# Altium schematic sheet MotorDriver.SchDoc
size A4; SheetNumber: 4; SheetTotal: 8
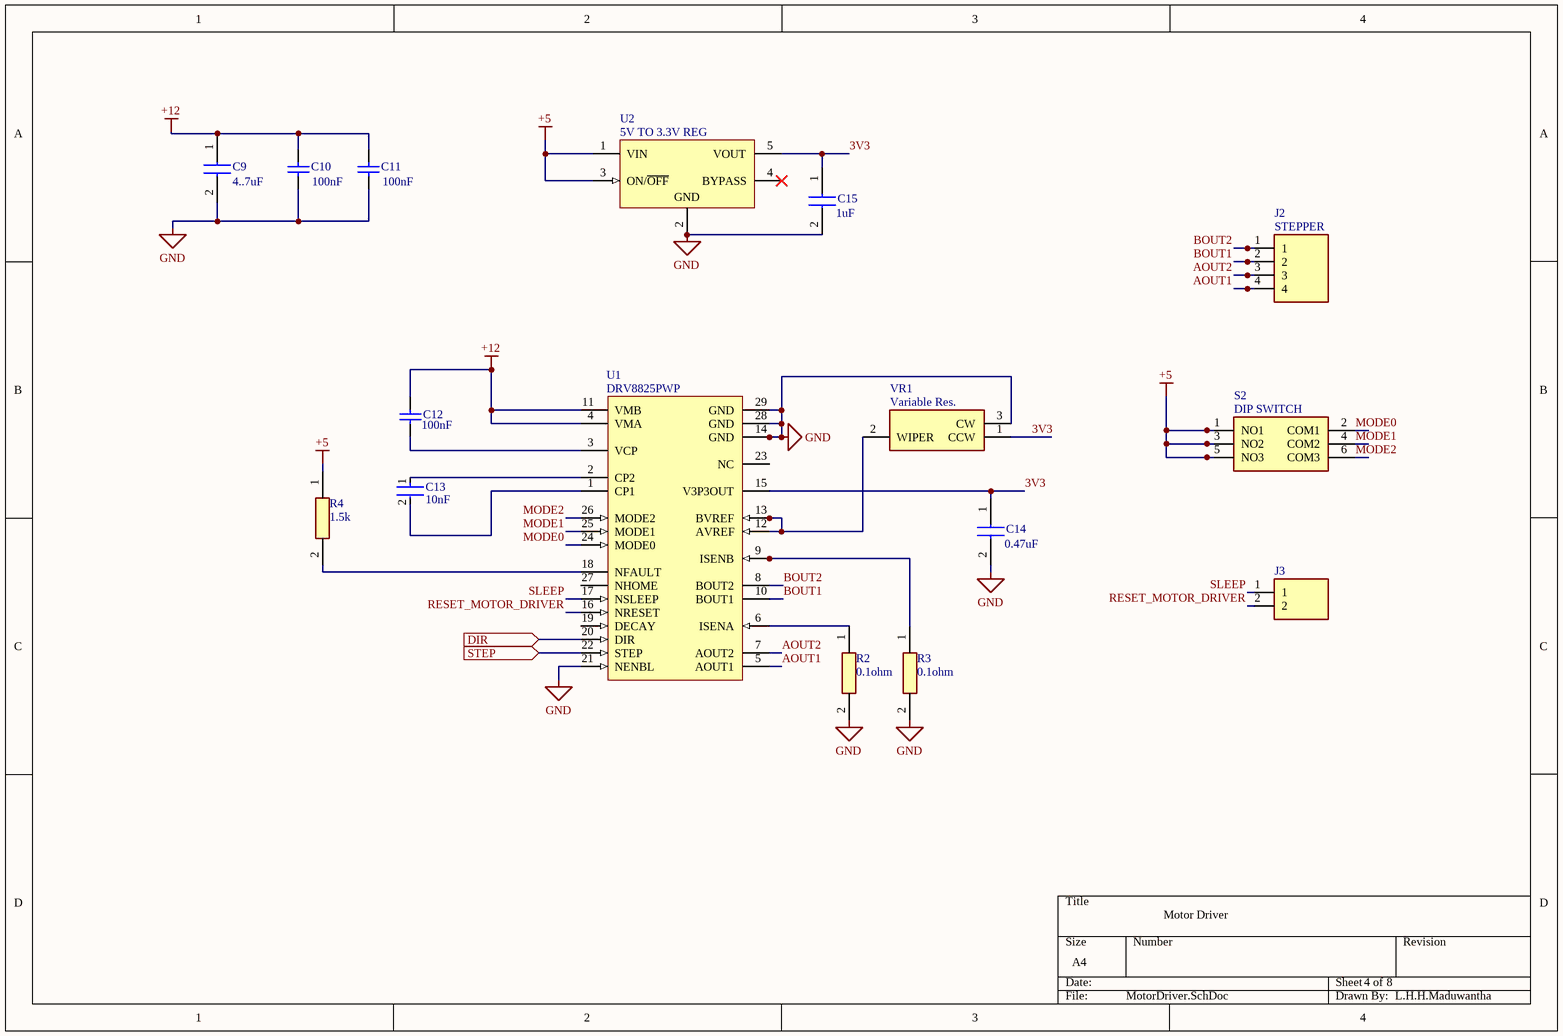
[diagram p0: MotorDriver.SchDoc]

## Parts
C9  Capacitance: 4..7uF  [C1210]  (hidden comment: C1210C475J5RACAUTO)
C10  value 100nF  [CAPC1608X90X35LL15T15]  (hidden comment: 06035C104KAT4A)
C11  value 100nF  [CAPC1608X90X35LL15T15]  (hidden comment: 06035C104KAT4A)
C12  value 100nF  [CAPC1608X90X35LL15T15]  (hidden comment: 06035C104KAT4A)
C13  Capacitance: 10nF  [FP-GRM155-0_05-IPC_A]  (hidden comment: GRM155R71H103JA88D)
C14  Capacitance: 0.47uF  [CAPC2012X110N]  (hidden comment: C0805C474J5REC7800)
C15  CAPACITANCE: 1uF  [CAPC1608X95N]  (hidden comment: C0603C105K3PACTU.)
J2  NAME: STEPPER  [B4BXHALFSN]  (hidden comment: B4B-XH-A_LF__SN_)
J3  61300211121  [HDRV2W110P0X254_1X2_508X254X854P]  (value not drawn)
R2  Resistance: 0.1ohm  [ERJ3_B_BQ_BW_LW_(0603)]  (hidden comment: ERJ-3RSFR10V)
R3  Resistance: 0.1ohm  [ERJ3_B_BQ_BW_LW_(0603)]  (hidden comment: ERJ-3RSFR10V)
R4  RESISTANCE: 1.5k  [ERA2AED122X]  (hidden comment: ERA-2AEB152X)
S2  NAME: DIP SWITCH  [BD03]  (hidden comment: BD03)
U1  DRV8825PWP  [PWP0028C_L]
U2  NAME: 5V TO 3.3V REG  [DBV0005A_M]  (hidden comment: LP2985-33DBVR)
VR1  NAME: Variable Res.  [TC33X2503E]  (hidden comment: TC33X-2-103E)

## Ports
DIR (in, see Main[3A]), STEP (in, see Main[3A])

## Nets
+5: R4.1 S2.1(NO1) S2.3(NO2) S2.5(NO3) U2.1(VIN) U2.3(ON/~{OFF})
+12: C9.1 C10.2 C11.2 C12.2 U1.4(VMA) U1.11(VMB)
GND: C9.2 C10.1 C11.1 C14.2 C15.2 R2.2 R3.2 U1.14(GND) U1.21(NENBL) U1.28(GND) U1.29(GND) U2.2(GND) VR1.3(CW)
3V3: C14.1 C15.1 U1.15(V3P3OUT) U2.5(VOUT) VR1.1(CCW)
AOUT1: J2.4 U1.5(AOUT1)
AOUT2: J2.3 U1.7(AOUT2)
BOUT1: J2.2 U1.10(BOUT1)
BOUT2: J2.1 U1.8(BOUT2)
DIR: U1.20(DIR) ; port DIR
MODE0: S2.2(COM1) U1.24(MODE0)
MODE1: S2.4(COM2) U1.25(MODE1)
MODE2: S2.6(COM3) U1.26(MODE2)
RESET_MOTOR_DRIVER: J3.2 U1.16(NRESET)
SLEEP: J3.1 U1.17(NSLEEP)
STEP: U1.22(STEP) ; port STEP
NetC12_1: C12.1 U1.3(VCP)
NetC13_1: C13.1 U1.2(CP2)
NetC13_2: C13.2 U1.1(CP1)
NetR2_1: R2.1 U1.6(ISENA)
NetR3_1: R3.1 U1.9(ISENB)
NetR4_2: R4.2 U1.18(NFAULT)
NetU1_12: U1.12(AVREF) U1.13(BVREF) VR1.2(WIPER)

Not connected (* = marked no-connect by the designer): U1 19(DECAY) 23(NC) 27(NHOME); U2 4(BYPASS)*

## Notes on the sheet
- Motor Driver
- L.H.H.Maduwantha

## Library data of the parts
C9 = C1210C475J5RACAUTO: Capacitor; Manufacturer_Name: KEMET; Datasheet Link: https://content.kemet.com/datasheets/KEM_C1023_X7R_AUTO_SMD.pdf; Manufacturer_Part_Number: C1210C475J5RACAUTO; Mouser Part Number: 80-C1210C475J5RAUTO; Mouser Price/Stock: https://www.mouser.co.uk/ProductDetail/KEMET/C1210C475J5RACAUTO?qs=sSYV1F9c5cHOvq7Y3pUhfA%3D%3D
C10-C12 = CMP-2006-04390-1: Manufacturer: AVX Interconnect / Elco; Part Number: 06035C104KAT4A
C13 = CMP-2008-04636-2: Chip Multilayer Ceramic Capacitors for General Purpose, 0402, 10000pF, X7R, 15%, 5%, 50V; Depth: 0.5mm; Case Code (Imperial): 0402; Dielectric: X7R; Voltage: 50V; Min Operating Temperature: -55°C; Packaging: Tape and Reel; Tolerance: 5%; Case Code (Metric): 1005; Package Quantity: 10000; Lead Free: Lead Free; Length: 1mm; Voltage Rating (DC): 50V; Termination: SMD/SMT; Width: 0.5mm; Height: 0.5mm; Voltage Rating: 50V; Case/Package: 0402; Max Operating Temperature: 125°C; Thickness: 0.022inch; Mount: Surface Mount; Material: Ceramic
C14 = C0805C474J5REC7800: Capacitor; Manufacturer_Name: KEMET; Datasheet Link: https://api.kemet.com/component-edge/download/datasheet/C0805C474J5REC7800.pdf; Height: 1.1mm; Manufacturer_Part_Number: C0805C474J5REC7800; Mouser Part Number: N/A; Mouser Price/Stock: https://www.mouser.co.uk/ProductDetail/KEMET/C0805C474J5REC7800?qs=xZ%2FP%252Ba9zWqYCFwa%2FovZJlA%3D%3D
C15 = C0603C105K3PACTU.: Capacitor; Manufacturer_Name: KEMET; Datasheet Link: https://www.kemet.com/specsheet/C0603C105K3PACTU; Height: 0.95mm; Manufacturer_Part_Number: C0603C105K3PACTU.; Mouser Part Number: N/A; Mouser Price/Stock: https://www.mouser.com/Search/Refine.aspx?Keyword=N%2FA
J2 = B4B-XH-A_LF__SN_: Connector; Manufacturer_Name: JST (JAPAN SOLDERLESS TERMINALS); Manufacturer_Part_Number: B4B-XH-A(LF)(SN); Datasheet Link: https://datasheet.lcsc.com/szlcsc/JST-Sales-America-B4B-XH-A-LF-SN_C144395.pdf; Height: 7mm; Arrow Part Number: B4B-XH-A(LF)(SN); Arrow Price/Stock: https://www.arrow.com/en/products/b4b-xh-a-lf-sn/jst-manufacturing?region=europe
J3 = 61300211121: Connector; Manufacturer_Name: Wurth Elektronik; Datasheet Link: https://componentsearchengine.com/Datasheets/2/61300211121.pdf; Height: 8.54mm; Manufacturer_Part_Number: 61300211121; Mouser Part Number: 710-61300211121; Mouser Price/Stock: https://www.mouser.co.uk/ProductDetail/Wurth-Elektronik/61300211121?qs=t4813l51qx%252B1A5GYDQxPlw%3D%3D
R2 R3 = ERJ-3RSFR10V: Resistor; Manufacturer_Name: Panasonic; Datasheet Link: http://industrial.panasonic.com/cdbs/www-data/pdf/RDN0000/AOA0000C313.pdf; Manufacturer_Part_Number: ERJ-3RSFR10V; Mouser Part Number: 667-ERJ-3RSFR10V; Mouser Price/Stock: https://www.mouser.co.uk/ProductDetail/Panasonic/ERJ-3RSFR10V?qs=aGgfWYEhH7mX3YEBaR1Eig%3D%3D; Arrow Part Number: ERJ-3RSFR10V; Arrow Price/Stock: https://www.arrow.com/en/products/erj-3rsfr10v/panasonic?region=nac
R4 = ERA-2AEB152X: Resistor; Manufacturer_Name: Panasonic; Datasheet Link: http://industrial.panasonic.com/cdbs/www-data/pdf/RDM0000/AOA0000C307.pdf; Height: 0.4mm; Manufacturer_Part_Number: ERA-2AEB152X; Mouser Part Number: 667-ERA-2AEB152X; Mouser Price/Stock: https://www.mouser.co.uk/ProductDetail/Panasonic/ERA-2AEB152X?qs=YFwoyZoVY0iUWeAxCO29sQ%3D%3D; Arrow Part Number: ERA-2AEB152X; Arrow Price/Stock: https://www.arrow.com/en/products/era-2aeb152x/panasonic?region=nac
S2 = BD03: Switch; Manufacturer_Name: C & K COMPONENTS; Datasheet Link: https://www.ckswitches.com/media/1331/bd.pdf; Manufacturer_Part_Number: BD03; Mouser Part Number: 611-BD03; Mouser Price/Stock: https://www.mouser.co.uk/ProductDetail/CK/BD03?qs=mh%2FGhdZp9qUYvDBbhZvRdQ%3D%3D; Arrow Part Number: BD03; Arrow Price/Stock: https://www.arrow.com/en/products/bd03/ck?region=nac
U1 = CMP-1685-00019-1: Stepper Motor Controller IC, 8.2 to 45 V, -40 to 85 degC, 28-Pin HTSSOP (PWP), Green (RoHS & no Sb/Br), Tube; Voltage Rating: 100 V; Tolerance: 20%; Capacitance: 47 uF; Case\Package: Radial; ComponentLink2URL: http://www.ti.com/general/docs/lit/getliterature.tsp?genericPartNumber=DRV8825&fileType=pdf; Voltage Rating (DC): 100 V; Lead Pitch: 3.5 mm; Diameter: 8 mm; DatasheetVersion: SLVSA73F, 07/2014; ComponentLink2Description: Datasheet; Package Quantity: 200; PackageDescription: 28-Pin Small Outline Package Integrated Circuit, Body 9.7 x 4.4 mm, Pitch 0.65 mm; Packaging: Bulk; Pins: 2; Min Operating Temperature: -40 degC; Width: 8 mm; ComponentLink1Description: Manufacturer URL; Length: 11.5 mm; Max Operating Temperature: 85 degC; Height: 11.5 mm; REACH SVHC: No SVHC; Mount: Through Hole; PackageReference: PWP0028C; RoHSCompliant: true; Radiation Hardening: No; ComponentLink1URL: http://www.ti.com/
U2 = CMP-0758-00080-2: Single Output Low Noise LDO, 150 mA, Fixed 3.3 V Output, 1.5% Tolerance, 2.2 to 16 V Input, Low IQ, 5-Pin SOT-23 (DBV), -40 to 125 degC, Green (RoHS & no Sb/Br), Tape and Reel; Manufacturer: Texas Instruments; Vdo (Typ) (mV): 280; Accuracy (%): 1.5; Output Options: Fixed Output; Fixed Output Options (V): 3.3; Iout (Max) (A): 0.15; Iq (Typ) (mA): 0.85; ComponentLink3Description: Package Specification; Packing: Tape and Reel; ComponentLink3URL: http://www.ti.com/litv/pdf/mpds018j; Vin (V): 2.2 to 16; Mounting Technology: Surface Mount; ComponentLink1URL: http://www.ti.com/; PartNumber: LP2985-33DBVR; PackageReference: DBV0005A; ComponentLink2URL: http://www.ti.com/lit/ds/symlink/lp2985-50.pdf; RoHS: TRUE; ComponentLink2Description: Datasheet; PackageVersion: 4073253-4/L; Operating Temperature Range (degC): -40 to 125; DatasheetVersion: SLVS522N; ComponentLink1Description: Manufacturer URL; PackageDescription: 5-Pin Plastic Small Outline, Body 2.9 x 1.6 mm, Pitch 0.95 mm
VR1 = TC33X-2-103E: Variable Resistor; Manufacturer_Name: Bourns; Datasheet Link: https://www.bourns.com/pdfs/TC33.pdf; Height: 1.2mm; Manufacturer_Part_Number: TC33X-2-103E; Mouser Part Number: 652-TC33X-2-103E; Mouser Price/Stock: https://www.mouser.co.uk/ProductDetail/Bourns/TC33X-2-103E?qs=fmZCN1JtwVHu68GrI%2FXOWQ%3D%3D; Arrow Part Number: TC33X-2-103E; Arrow Price/Stock: https://www.arrow.com/en/products/tc33x-2-103e/bourns?region=nac